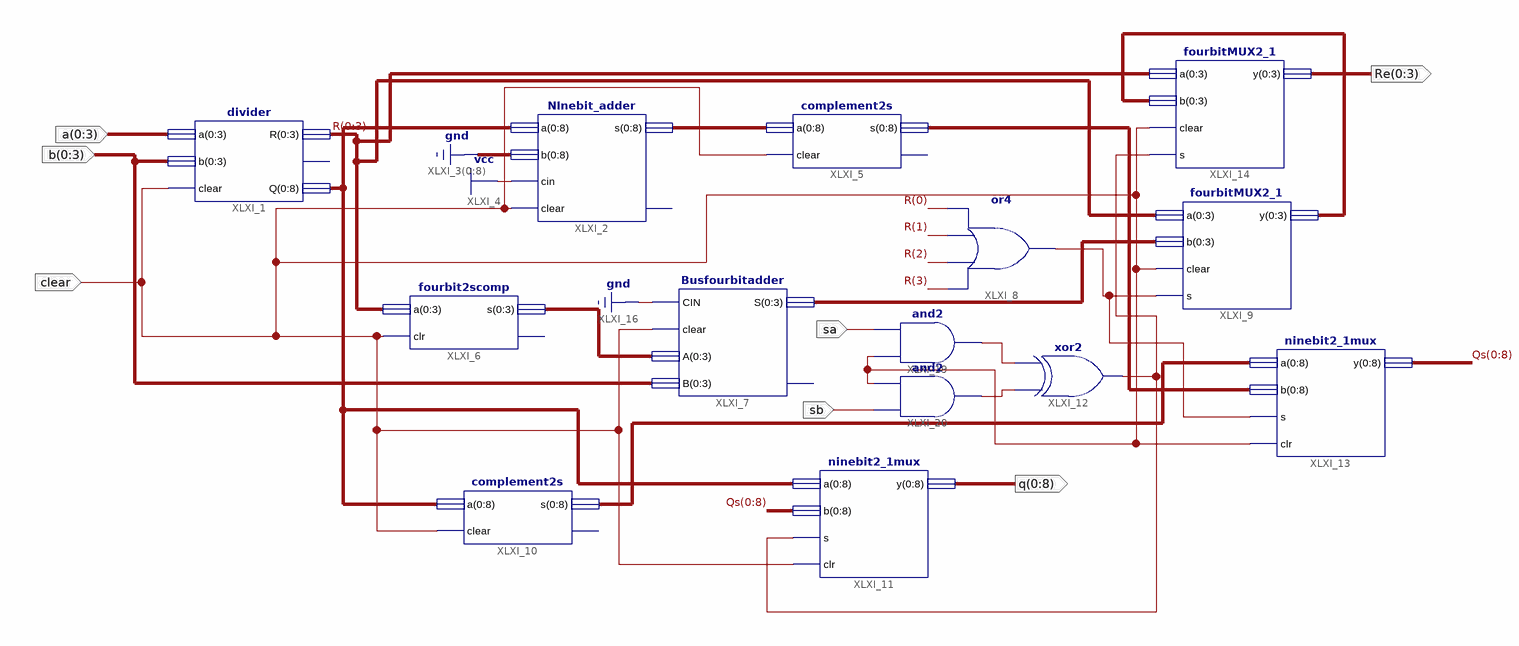
[diagram p0: schematic sheet 1]
// Xilinx ISE schematic newsigned_divider.sch (artix7) as structural Verilog: 14 symbols, 7 ports
module newsigned_divider (
  input  [0:3] b,
  input  [0:3] a,
  input  clear,
  input  sa,
  input  sb,
  output [0:8] q,
  output [0:3] Re
);

  wire v, x, XLXN_91, XLXN_97;
  wire [3:0] R, XLXN_75, XLXN_77, XLXN_98;
  wire [8:0] Qs, XLXN_72, XLXN_73, XLXN_109, XLXN_110;

  divider XLXI_1 (
    .a(a), .b(b), .clear(clear), .R({R[0], R[1], R[2], R[3]}),
    .Q({XLXN_109[0], XLXN_109[1], XLXN_109[2], XLXN_109[3], XLXN_109[4], XLXN_109[5], XLXN_109[6], XLXN_109[7], XLXN_109[8]}));  // open: cout
  NInebit_adder XLXI_2 (
    .a({XLXN_109[0], XLXN_109[1], XLXN_109[2], XLXN_109[3], XLXN_109[4], XLXN_109[5], XLXN_109[6], XLXN_109[7], XLXN_109[8]}),
    .b({9{1'b0}}), .cin(1'b1), .clear(clear),
    .s({XLXN_72[0], XLXN_72[1], XLXN_72[2], XLXN_72[3], XLXN_72[4], XLXN_72[5], XLXN_72[6], XLXN_72[7], XLXN_72[8]}));  // open: cout
  complement2s XLXI_5 (
    .a({XLXN_72[0], XLXN_72[1], XLXN_72[2], XLXN_72[3], XLXN_72[4], XLXN_72[5], XLXN_72[6], XLXN_72[7], XLXN_72[8]}),
    .clear(clear),
    .s({XLXN_73[0], XLXN_73[1], XLXN_73[2], XLXN_73[3], XLXN_73[4], XLXN_73[5], XLXN_73[6], XLXN_73[7], XLXN_73[8]}));  // open: cout
  fourbit2scomp XLXI_6 (
    .a({R[0], R[1], R[2], R[3]}), .clr(clear), .s({XLXN_75[0], XLXN_75[1], XLXN_75[2], XLXN_75[3]}));  // open: cout
  Busfourbitadder XLXI_7 (
    .CIN(1'b0), .clear(clear), .A({XLXN_75[0], XLXN_75[1], XLXN_75[2], XLXN_75[3]}), .B(b),
    .S({XLXN_77[0], XLXN_77[1], XLXN_77[2], XLXN_77[3]}));  // open: cout
  or XLXI_8 (XLXN_91, R[3], R[2], R[1], R[0]);
  fourbitMUX2_1 XLXI_9 (
    .a({R[0], R[1], R[2], R[3]}), .b({XLXN_77[0], XLXN_77[1], XLXN_77[2], XLXN_77[3]}), .clear(clear),
    .s(XLXN_91), .y({XLXN_98[0], XLXN_98[1], XLXN_98[2], XLXN_98[3]}));
  complement2s XLXI_10 (
    .a({XLXN_109[0], XLXN_109[1], XLXN_109[2], XLXN_109[3], XLXN_109[4], XLXN_109[5], XLXN_109[6], XLXN_109[7], XLXN_109[8]}),
    .clear(clear),
    .s({XLXN_110[0], XLXN_110[1], XLXN_110[2], XLXN_110[3], XLXN_110[4], XLXN_110[5], XLXN_110[6], XLXN_110[7], XLXN_110[8]}));  // open: cout
  ninebit2_1mux XLXI_11 (
    .a({XLXN_109[0], XLXN_109[1], XLXN_109[2], XLXN_109[3], XLXN_109[4], XLXN_109[5], XLXN_109[6], XLXN_109[7], XLXN_109[8]}),
    .b({Qs[0], Qs[1], Qs[2], Qs[3], Qs[4], Qs[5], Qs[6], Qs[7], Qs[8]}), .s(XLXN_97), .clr(clear), .y(q));
  xor XLXI_12 (XLXN_97, v, x);
  ninebit2_1mux XLXI_13 (
    .a({XLXN_110[0], XLXN_110[1], XLXN_110[2], XLXN_110[3], XLXN_110[4], XLXN_110[5], XLXN_110[6], XLXN_110[7], XLXN_110[8]}),
    .b({XLXN_73[0], XLXN_73[1], XLXN_73[2], XLXN_73[3], XLXN_73[4], XLXN_73[5], XLXN_73[6], XLXN_73[7], XLXN_73[8]}),
    .s(XLXN_91), .clr(clear), .y({Qs[0], Qs[1], Qs[2], Qs[3], Qs[4], Qs[5], Qs[6], Qs[7], Qs[8]}));
  fourbitMUX2_1 XLXI_14 (
    .a({R[0], R[1], R[2], R[3]}), .b({XLXN_98[0], XLXN_98[1], XLXN_98[2], XLXN_98[3]}), .clear(clear),
    .s(XLXN_97), .y(Re));
  and XLXI_19 (x, clear, sa);
  and XLXI_20 (v, sb, clear);
endmodule
